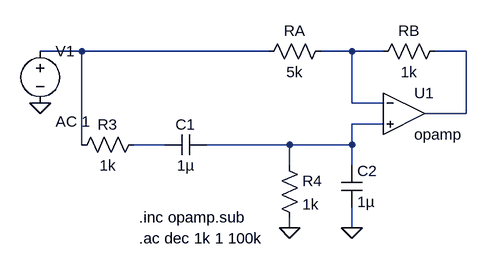
[diagram p0: schematic Draft2.asc]
Draft2.asc, the LTspice schematic file:
Version 4
SHEET 1 880 680
WIRE 32 64 -32 64
WIRE 320 64 32 64
WIRE 448 64 400 64
WIRE 496 64 448 64
WIRE 624 64 576 64
WIRE 448 144 448 64
WIRE 496 144 448 144
WIRE 624 160 624 64
WIRE 624 160 560 160
WIRE 496 176 448 176
WIRE 32 208 32 64
WIRE 160 208 112 208
WIRE 352 208 224 208
WIRE 448 208 448 176
WIRE 448 208 352 208
WIRE 352 240 352 208
WIRE 448 240 448 208
WIRE 352 336 352 320
WIRE 448 336 448 304
FLAG 352 336 0
FLAG 448 336 0
FLAG -32 144 0
SYMBOL res 128 192 R90
WINDOW 0 0 56 VBottom 2
WINDOW 3 32 56 VTop 2
SYMATTR InstName R3
SYMATTR Value 1k
SYMBOL cap 224 192 R90
WINDOW 0 0 32 VBottom 2
WINDOW 3 32 32 VTop 2
SYMATTR InstName C1
SYMATTR Value 1µ
SYMBOL res 336 224 R0
SYMATTR InstName R4
SYMATTR Value 1k
SYMBOL cap 432 240 R0
SYMATTR InstName C2
SYMATTR Value 1µ
SYMBOL OpAmps\\opamp 528 96 R0
SYMATTR InstName U1
SYMBOL res 416 48 R90
WINDOW 0 0 56 VBottom 2
WINDOW 3 32 56 VTop 2
SYMATTR InstName RA
SYMATTR Value 5k
SYMBOL res 592 48 R90
WINDOW 0 0 56 VBottom 2
WINDOW 3 32 56 VTop 2
SYMATTR InstName RB
SYMATTR Value 1k
SYMBOL voltage -32 48 R0
WINDOW 123 24 124 Left 2
WINDOW 39 0 0 Left 0
SYMATTR InstName V1
SYMATTR Value ""
SYMATTR Value2 AC 1
TEXT 120 320 Left 2 !.inc opamp.sub
TEXT 120 352 Left 2 !.ac dec 1k 1 100k

The netlist it stands for:
* Draft2.asc
R3 N005 N001 1k
C1 N004 N005 1µ
R4 N004 0 1k
C2 N004 0 1µ
XU1 N002 N004 N003 opamp Aol=100K GBW=10Meg  ; pins invin noninvin out
RA N002 N001 5k
RB N003 N002 1k
V1 N001 0 AC 1
.inc opamp.sub
.ac dec 1k 1 100k
.backanno
.end